# EAGLE schematic WaterDetector (EAGLE 7.4.0)
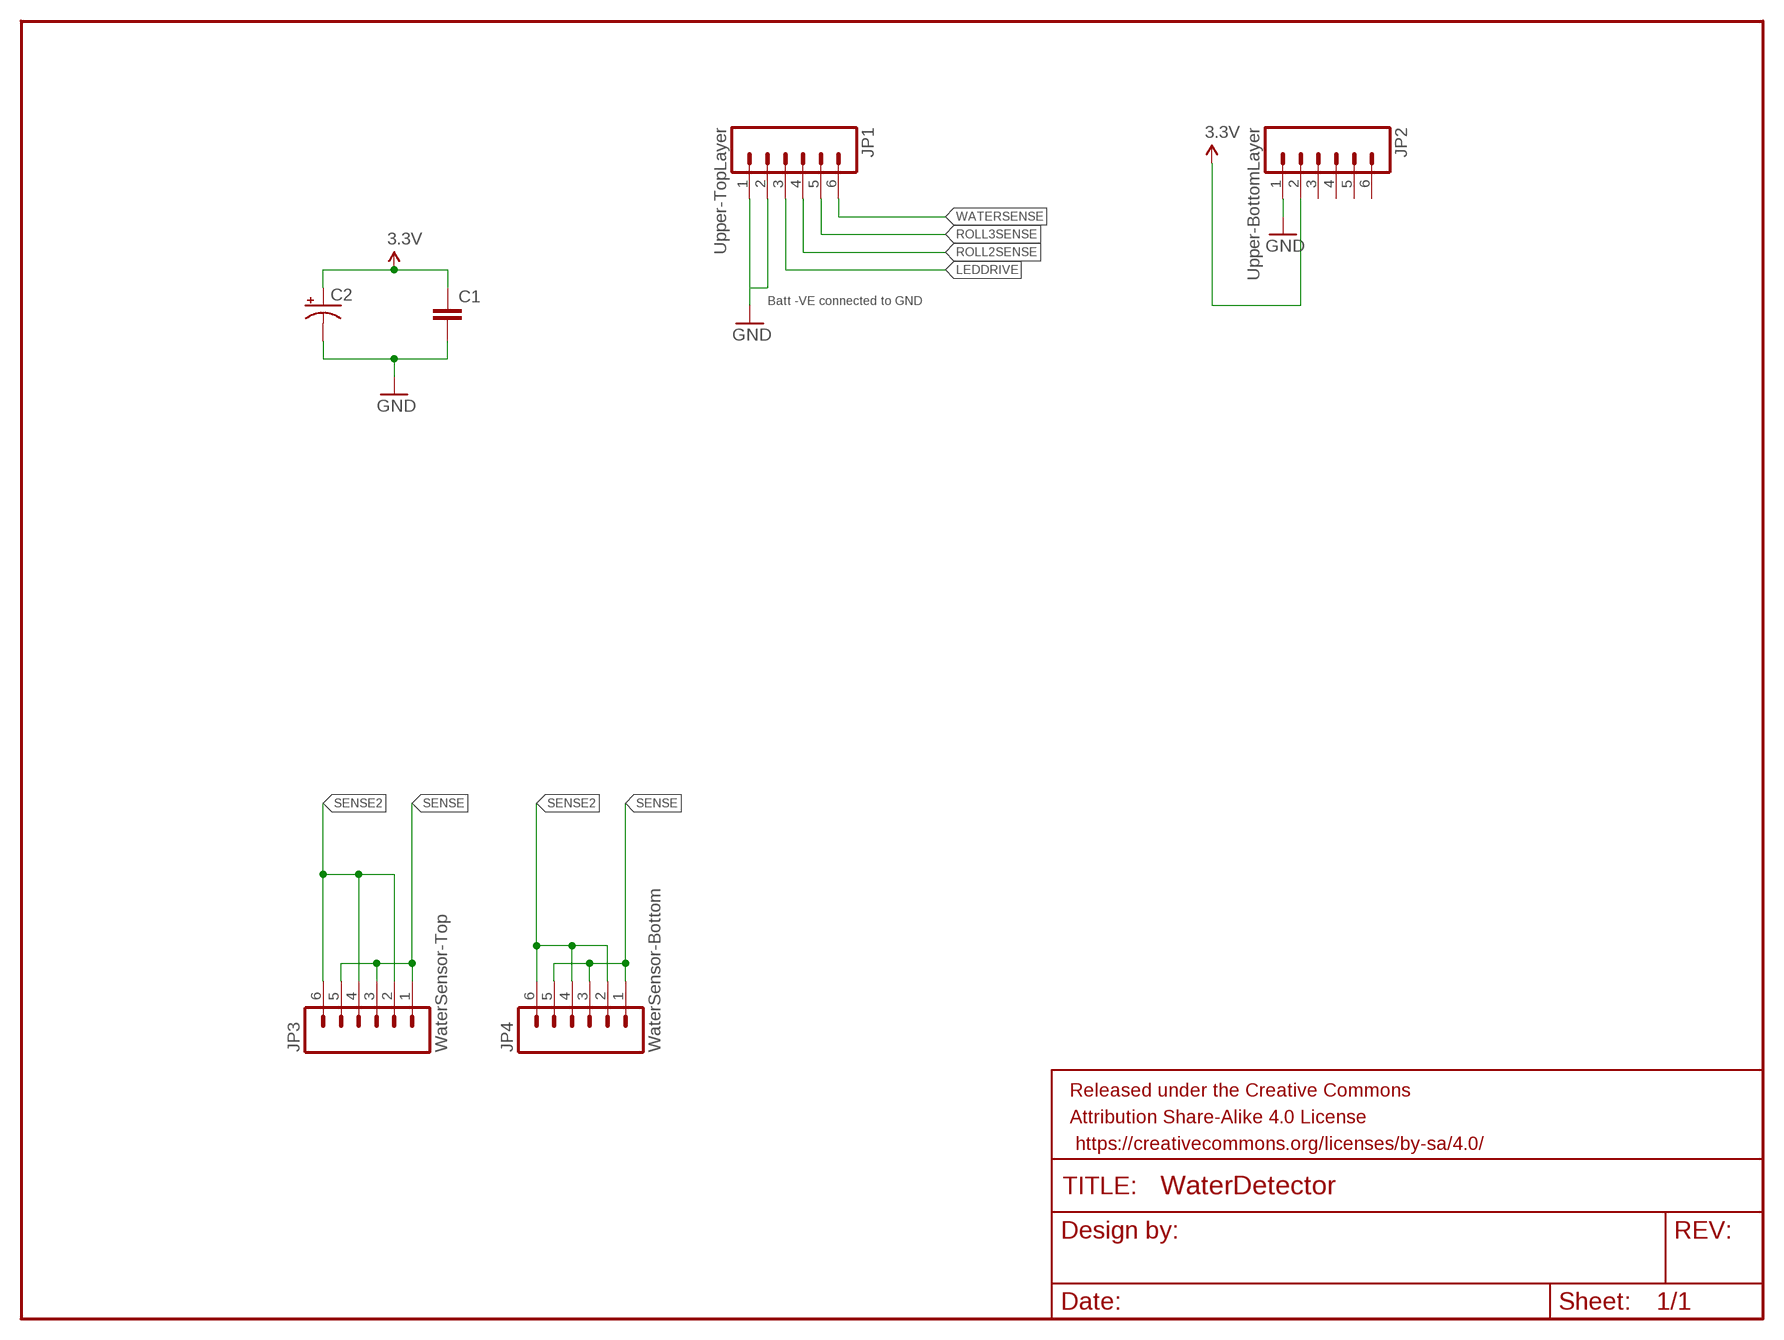
[diagram p0: schematic, sheet 1]

## Parts
C1  CAP0805  [0805]
C2  CAP_POLC  [PANASONIC_C]
FRAME1  FRAME-LETTER  [CREATIVE_COMMONS]
JP1  Upper-TopLayer  M061X06-SMD-EDGE-SOLDERLINK1X06-SMD-EDGE-SOLDERLINK  [1X06-SMD_EDGE]
JP2  Upper-BottomLayer  M061X06-SMD-EDGE-SOLDERLINK1X06-SMD-EDGE-SOLDERLINK  [1X06-SMD_EDGE]
JP3  WaterSensor-Top  M061X06-SMD-EDGE-SOLDERLINK1X06-SMD-EDGE-SOLDERLINK  [1X06-SMD_EDGE]
JP4  WaterSensor-Bottom  M061X06-SMD-EDGE-SOLDERLINK1X06-SMD-EDGE-SOLDERLINK  [1X06-SMD_EDGE]

## Nets
3.3V: C1.1 C2.+ JP2.2
GND: C1.2 C2.- JP1.1 JP1.2 JP2.1
LEDDRIVE: JP1.3
ROLL2SENSE: JP1.4
ROLL3SENSE: JP1.5
SENSE: JP3.1 JP3.3 JP3.5 JP4.1 JP4.3 JP4.5
SENSE2: JP3.2 JP3.4 JP3.6 JP4.2 JP4.4 JP4.6
WATERSENSE: JP1.6
Unconnected: JP2.3 JP2.4 JP2.5 JP2.6

## Notes on the sheet
- Batt -VE connected to GND

## Library data of the parts
C1 = SparkFun-Capacitors:CAP: Capacitor Standard 0603 ceramic capacitor, and 0.1" leaded capacitor.
C2 = SparkFun-Capacitors:CAP_POL: Capacitor Polarized These are standard SMD and PTH capacitors. Normally 10uF, 47uF, and 100uF in electrolytic and tantalum varieties. Always verify the external diameter of the through hole cap, it varies with capacity, voltage, and manufacturer. The EIA devices should be standard.
FRAME1 = SparkFun-Aesthetics:FRAME-LETTER: Schematic Frame Standard 8.5x11 US Letter frame
JP1-JP4 = Tinamous:M06: Header 6 Standard 6-pin 0.1" header. Use with straight break away headers (SKU : PRT-00116), right angle break away headers (PRT-00553), swiss pins (PRT-00743), machine pins (PRT-00117), and female headers (PRT-00115). Molex polarized connector foot print use with SKU : PRT-08094 with associated crimp pins and housings. NOTES ON THE VARIANTS LOCK and LOCK_LONGPADS... This footprint was designed to help hold the alignment of a through-hole component (i.e. 6-pin header) while soldering it into place. You may notice that each hole has been shifted either up or down by 0.005 of an inch from it's more standard position (which is a perfectly straight line). This slight alteration caused the pins (the squares in the middle) to touch the edges of the holes. Because they are alternating, it causes a "brace" to hold the component in place. 0.005 has proven to be the perfect amount of "off-center" position when using our standard breakaway headers. Although looks a little odd when you look at the bare footprint, once you have a header in there, the alteration is very hard to notice. Also,if you push a header all the way into place, it is covered up entirely on the bottom side. This idea of altering the position of holes to aid alignment will be further integrated into the Sparkfun Library for other footprints. It can help hold any component with 3 or more connection pins.